# Altium schematic sheet MercurialSDR_USB_Regulator.SchDoc
size A4
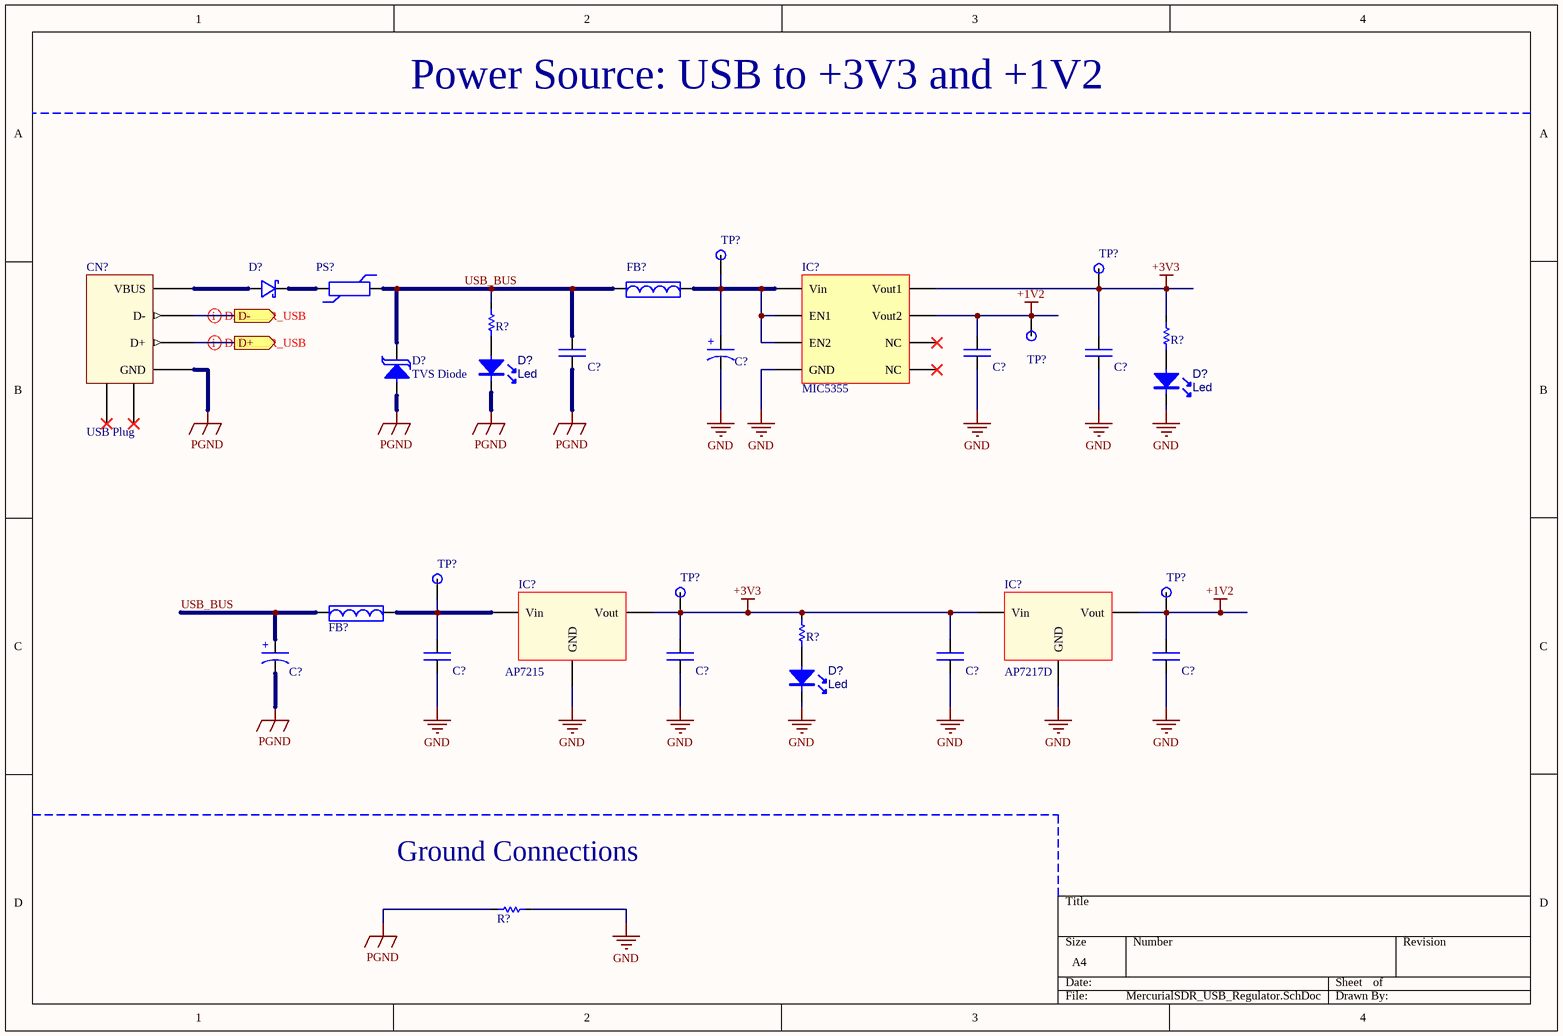
[diagram p0: MercurialSDR_USB_Regulator.SchDoc]

## Parts
(Parts that share a designator on the sheet are numbered #1, #2 ... from top to bottom, then left to right.)
C?#1  Capacitor  [CAP_0603]  (value not drawn)
C?#2  Capacitor Polarizado  (value not drawn)
C?#3  Capacitor  [CAP_0603]  (value not drawn)
C?#4  Capacitor  [CAP_0603]  (value not drawn)
C?#5  Capacitor Polarizado  (value not drawn)
C?#6  Capacitor  [CAP_0603]  (value not drawn)
C?#7  Capacitor  [CAP_0603]  (value not drawn)
C?#8  Capacitor  [CAP_0603]  (value not drawn)
C?#9  Capacitor  [CAP_0603]  (value not drawn)
CN?  USB Plug
D?#1  Schottky Diode  (value not drawn)
D?#2  Led  [LED_0603]
D?#3  TVS Diode
D?#4  Led  [LED_0603]
D?#5  Led  [LED_0603]
FB?#1  Ferrite Bead  [FERRITE_BEAD_0603]  (value not drawn)
FB?#2  Ferrite Bead  [FERRITE_BEAD_0603]  (value not drawn)
IC?#1  MIC5355  [MSOP-8]
IC?#2  AP7215  [SOT89-3L]
IC?#3  AP7217D  [SOT89-3L]
PS?  Poliswitch  (value not drawn)
R?#1  Resistor SMD  [RES_0603]  (value not drawn)
R?#2  Resistor SMD  [RES_0603]  (value not drawn)
R?#3  Resistor SMD  [RES_0603]  (value not drawn)
R?#4  Resistor SMD  [RES_0603]  (value not drawn)
TP?#1  Test Point  (value not drawn)
TP?#2  Test Point  (value not drawn)
TP?#3  Test Point  (value not drawn)
TP?#4  Test Point  (value not drawn)
TP?#5  Test Point  (value not drawn)
TP?#6  Test Point  (value not drawn)

## Ports
D+ (out), D- (out)

## Nets
+1V2: C?#3.1 C?#9.1 IC?#1.7(Vout2) IC?#3.3(Vout) TP?#3.1(TP?) TP?#6.1(TP?)
+3V3: C?#4.1 C?#7.1 C?#8.1 IC?#1.8(Vout1) IC?#2.3(Vout) IC?#3.2(Vin) R?#2.1 R?#3.1 TP?#2.1(TP?) TP?#5.1(TP?)
GND: C?#2.2 C?#3.2 C?#4.2 C?#6.2 C?#7.2 C?#8.2 C?#9.2 D?#4.2(K) D?#5.2(K) IC?#1.2(GND) IC?#2.1(GND) IC?#3.1(GND) R?#4.1
PGND: C?#1.2 C?#5.2 CN?.4(GND) D?#2.2(K) D?#3.1(A) R?#4.2
D+: CN?.3(D+) ; port D+
D-: CN?.2(D-) ; port D-
USB_BUS: C?#1.1 C?#5.1 D?#3.2(K) FB?#1.1 FB?#2.1 PS?.2 R?#1.1
NetC?#2_1: C?#2.1 FB?#1.2 IC?#1.1(Vin) IC?#1.4(EN2) IC?#1.5(EN1) TP?#1.1(TP?)
NetC?#6_1: C?#6.1 FB?#2.2 IC?#2.2(Vin) TP?#4.1(TP?)
NetCN?_1: CN?.1(VBUS) D?#1.1(A)
NetD?#1_2: D?#1.2(K) PS?.1
NetD?#2_1: D?#2.1(A) R?#1.2
NetD?#4_1: D?#4.1(A) R?#2.2
NetD?#5_1: D?#5.1(A) R?#3.2

Not connected (* = marked no-connect by the designer): CN? 5(Shield)* 6(Shield)*; IC?#1 3(NC)* 6(NC)*

## Layout directives
differential pair: D+, D-

## Notes on the sheet
- Power Source: USB to +3V3 and +1V2
- (near R?#4) Ground Connections
- (in symbol Cap Pol) +

## Library data of the parts
C?#1 C?#3 C?#4 C?#6-C?#9 = Cap: Capacitor no polarizado; Value: *; Temp Coef: *; Part Number: *; VR: *; Material: *
C?#2 C?#5 = Cap Pol: Value: *; Temp Coef: *; Part Number: *; VR: *; Material: *
D?#1 = Diodo_Schottky: Diodo Schottkey; Part Number: *; In: *; VR: *
D?#3 = TVS_DIODE: TVS (Supresor de transitorios); Part Number: *; V: *
IC?#1 = MIC5355: Linea Regulator Dual; Part Number: *
IC?#2 = AP7215: Linear Voltage Regulator 3v3; Part Number: *
IC?#3 = AP7217D: Linear Voltage Regulator 1V2; Part Number: *
PS? = Poliswitch: Polishwitch; Part Number: *; Ih: *; V: *
R?#1-R?#4 = Res: Resistor; Power: *; Part Number: *; Tolerance: *
CN? = USB Plug: Part Number: *
D?#2 D?#4 D?#5 = Led: Color: *; Part Number: *
FB?#1 FB?#2 = Ferrite Bead: Part Number: *; In: *